# Altium project 222.PrjPCB
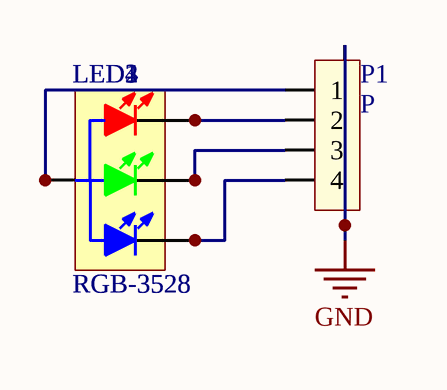
[diagram p0: 222.SchDoc]
1 sheet, 5 parts. Net scope: global (net labels, ports and power ports of the same name join across sheets).
Board file: 222.PcbDoc

## Sheet 222.SchDoc
size A4

### Parts
LED1  RGB-3528  [LED 3528-4Pin]
LED2  RGB-3528  [LED 3528-4Pin]
LED3  RGB-3528  [LED 3528-4Pin]
LED4  RGB-3528  [LED 3528-4Pin]
P1  P  [SH1.0_4pin]

### Nets
GND: P1.0
NetLED1_1: LED1.1(RED_K) LED2.1(RED_K) LED3.1(RED_K) LED4.1(RED_K) P1.2
NetLED1_2: LED1.2(GREEN_K) LED2.2(GREEN_K) LED3.2(GREEN_K) LED4.2(GREEN_K) P1.3
NetLED1_3: LED1.3(BULE_K) LED2.3(BULE_K) LED3.3(BULE_K) LED4.3(BULE_K) P1.4
NetLED1_4: LED1.4(A) LED2.4(A) LED3.4(A) LED4.4(A) P1.1

### Library data of the parts
LED1-LED4 = LED-RGB-3528: 三基色LED; 版权归属: 源创客; BOM名称: 三基色LED; 学习资源: www.ooocke.com
P1 = SH1.0-4